# EAGLE design floppyswitch_4layer_smd (EAGLE 7.7.0)
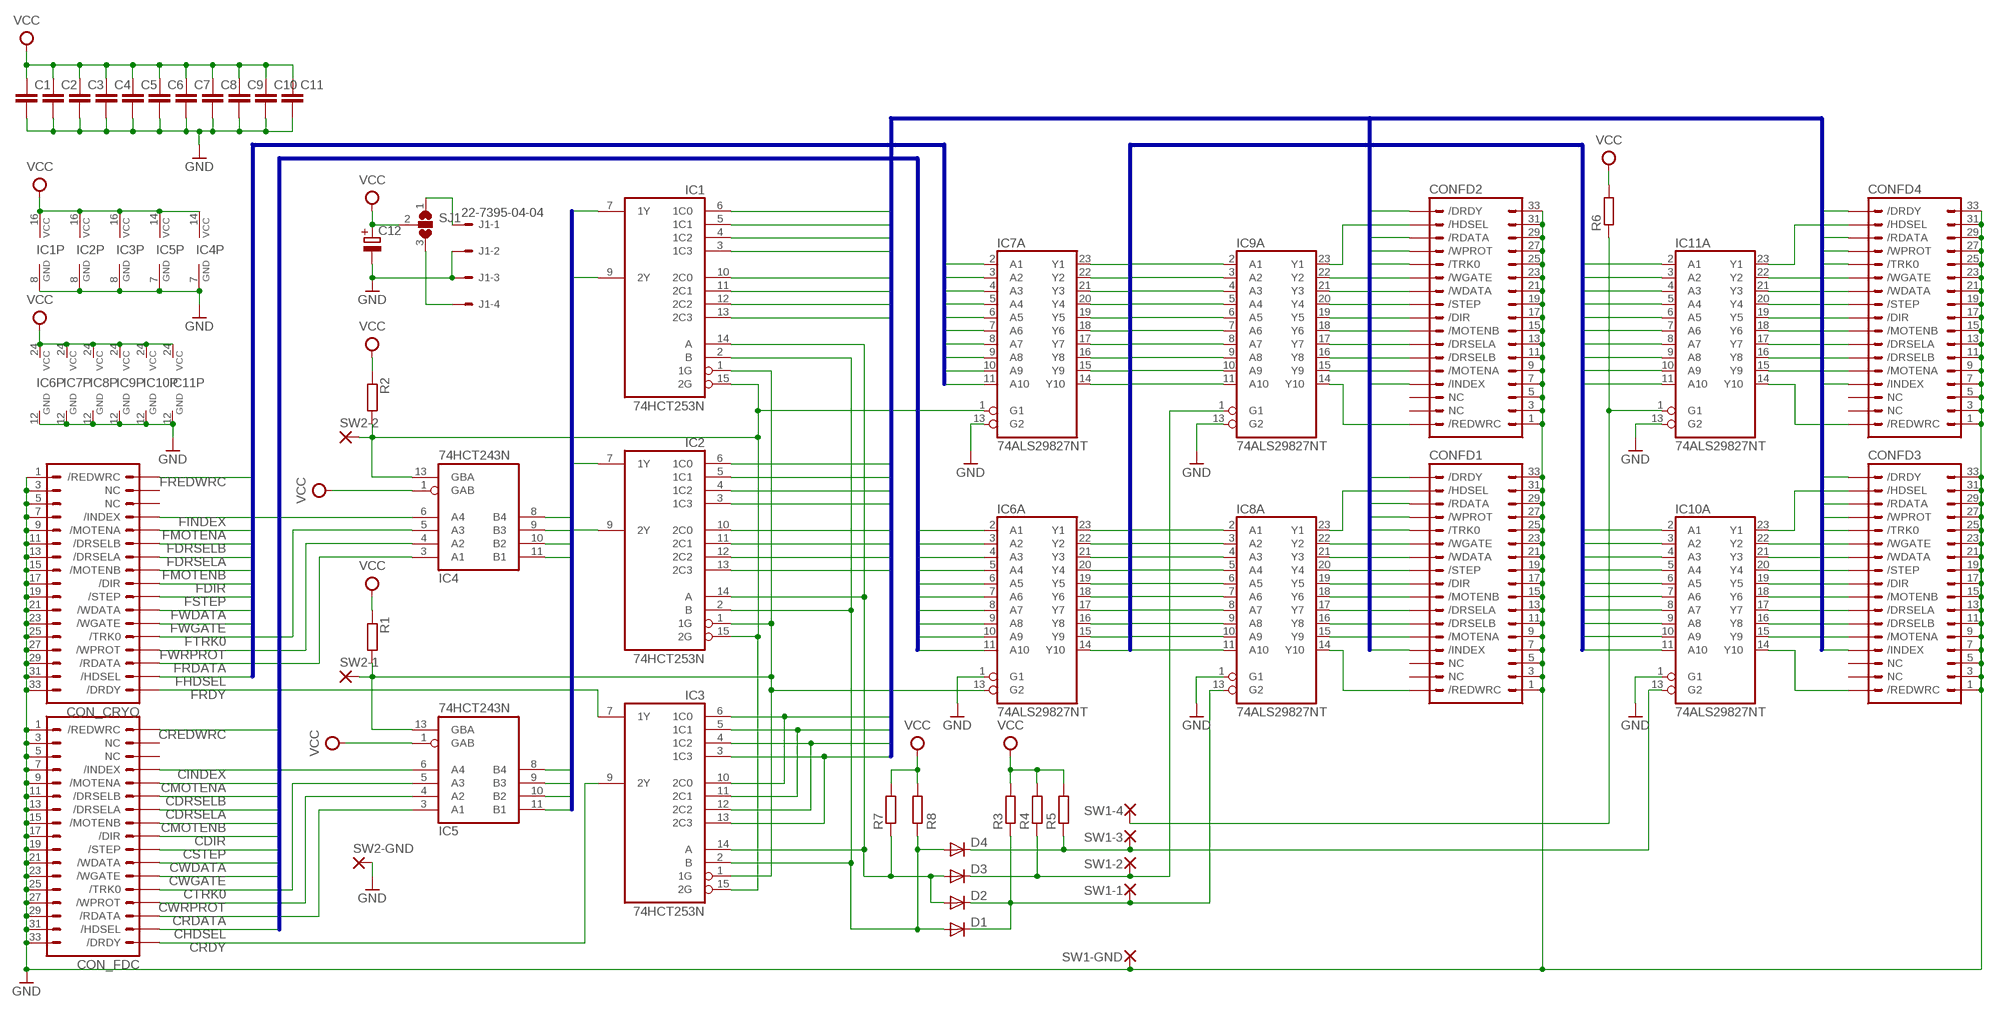
[diagram p0: schematic, sheet 1]

## Parts
C1  C-EU075-032X103  [C075-032X103]
C2  C-EU025-025X050  [C025-025X050]
C3  C-EU050-025X075  [C050-025X075]
C4  C-EU050-025X075  [C050-025X075]
C5  C-EU075-032X103  [C075-032X103]
C6  C-EU075-032X103  [C075-032X103]
C7  C-EU075-032X103  [C075-032X103]
C8  C-EU075-032X103  [C075-032X103]
C9  C-EU075-032X103  [C075-032X103]
C10  C-EU075-032X103  [C075-032X103]
C11  C-EU050-025X075  [C050-025X075]
C12  CPOL-EUE2.5-6  [E2,5-6]
CON_CRYO  FDC342X17  [2X17]
CON_FDC  FDC342X17  [2X17]
CONFD1  FDC342X17  [2X17]
CONFD2  FDC342X17  [2X17]
CONFD3  FDC342X17  [2X17]
CONFD4  FDC342X17  [2X17]
D1  1N4148-7  [DO35-7]
D2  1N4148-7  [DO35-7]
D3  1N4148-7  [DO35-7]
D4  1N4148-7  [DO35-7]
IC1  74HCT253N  [DIL16]
IC2  74HCT253N  [DIL16]
IC3  74HCT253N  [DIL16]
IC4  74HCT243N  [DIL14]
IC5  74HCT243N  [DIL14]
IC6  74ALS29827NT  [SO24W]
IC7  74ALS29827NT  [SO24W]
IC8  74ALS29827NT  [SO24W]
IC9  74ALS29827NT  [SO24W]
IC10  74ALS29827NT  [SO24W]
IC11  74ALS29827NT  [SO24W]
J1  22-7395-04-04  [7395-04]
R1  R-EU0207/10  [0207/10]
R2  R-EU0207/10  [0207/10]
R3  R-EU0207/10  [0207/10]
R4  R-EU0207/10  [0207/10]
R5  R-EU0207/10  [0207/10]
R6  R-EU0207/10  [0207/10]
R7  R-EU0207/10  [0207/10]
R8  R-EU0207/10  [0207/10]
SJ1  SJ2W  [SJ_2]
SW1-1  WIREPAD1,6/0,8  [1,6/0,8]
SW1-2  WIREPAD1,6/0,8  [1,6/0,8]
SW1-3  WIREPAD1,6/0,8  [1,6/0,8]
SW1-4  WIREPAD1,6/0,8  [1,6/0,8]
SW1-GND  WIREPAD1,6/0,8  [1,6/0,8]
SW2-1  WIREPAD1,6/0,8  [1,6/0,8]
SW2-2  WIREPAD1,6/0,8  [1,6/0,8]
SW2-GND  WIREPAD1,6/0,8  [1,6/0,8]

## Nets
BUS1: IC6.14(A:Y10) IC7.14(A:Y10) IC8.11(A:A10) IC9.11(A:A10) IC10.11(A:A10) IC11.11(A:A10)
BUS2: IC6.15(A:Y9) IC7.15(A:Y9) IC8.10(A:A9) IC9.10(A:A9) IC10.10(A:A9) IC11.10(A:A9)
BUS3: IC6.16(A:Y8) IC7.16(A:Y8) IC8.9(A:A8) IC9.9(A:A8) IC10.9(A:A8) IC11.9(A:A8)
BUS4: IC6.17(A:Y7) IC7.17(A:Y7) IC8.8(A:A7) IC9.8(A:A7) IC10.8(A:A7) IC11.8(A:A7)
BUS5: IC6.18(A:Y6) IC7.18(A:Y6) IC8.7(A:A6) IC9.7(A:A6) IC10.7(A:A6) IC11.7(A:A6)
BUS6: IC6.19(A:Y5) IC7.19(A:Y5) IC8.6(A:A5) IC9.6(A:A5) IC10.6(A:A5) IC11.6(A:A5)
BUS7: IC6.20(A:Y4) IC7.20(A:Y4) IC8.5(A:A4) IC9.5(A:A4) IC10.5(A:A4) IC11.5(A:A4)
BUS8: IC6.21(A:Y3) IC7.21(A:Y3) IC8.4(A:A3) IC9.4(A:A3) IC10.4(A:A3) IC11.4(A:A3)
BUS9: IC6.22(A:Y2) IC7.22(A:Y2) IC8.3(A:A2) IC9.3(A:A2) IC10.3(A:A2) IC11.3(A:A2)
BUS10: IC6.23(A:Y1) IC7.23(A:Y1) IC8.2(A:A1) IC9.2(A:A1) IC10.2(A:A1) IC11.2(A:A1)
CDIR: CON_FDC.18(/DIR) IC6.6(A:A5)
CDRSELA: CON_FDC.14(/DRSELA) IC6.8(A:A7)
CDRSELB: CON_FDC.12(/DRSELB) IC6.9(A:A8)
CHDSEL: CON_FDC.32(/HDSEL) IC6.2(A:A1)
CINDEX: CON_FDC.8(/INDEX) IC5.6(A4)
CMOTENA: CON_FDC.10(/MOTENA) IC6.10(A:A9)
CMOTENB: CON_FDC.16(/MOTENB) IC6.7(A:A6)
CRDATA: CON_FDC.30(/RDATA) IC5.3(A1)
CRDY: CON_FDC.34(/DRDY) IC3.9(2Y)
CREDWRC: CON_FDC.2(/REDWRC) IC6.11(A:A10)
CSTEP: CON_FDC.20(/STEP) IC6.5(A:A4)
CTRK0: CON_FDC.26(/TRK0) IC5.5(A3)
CWDATA: CON_FDC.22(/WDATA) IC6.4(A:A3)
CWGATE: CON_FDC.24(/WGATE) IC6.3(A:A2)
CWRPROT: CON_FDC.28(/WPROT) IC5.4(A2)
FDIR: CON_CRYO.18(/DIR) IC7.6(A:A5)
FDRSELA: CON_CRYO.14(/DRSELA) IC7.8(A:A7)
FDRSELB: CON_CRYO.12(/DRSELB) IC7.9(A:A8)
FHDSEL: CON_CRYO.32(/HDSEL) IC7.2(A:A1)
FINDEX: CON_CRYO.8(/INDEX) IC4.6(A4)
FMOTENA: CON_CRYO.10(/MOTENA) IC7.10(A:A9)
FMOTENB: CON_CRYO.16(/MOTENB) IC7.7(A:A6)
FRDATA: CON_CRYO.30(/RDATA) IC4.3(A1)
FRDY: CON_CRYO.34(/DRDY) IC3.7(1Y)
FREDWRC: CON_CRYO.2(/REDWRC) IC7.11(A:A10)
FSTEP: CON_CRYO.20(/STEP) IC7.5(A:A4)
FTRK0: CON_CRYO.26(/TRK0) IC4.5(A3)
FWDATA: CON_CRYO.22(/WDATA) IC7.4(A:A3)
FWGATE: CON_CRYO.24(/WGATE) IC7.3(A:A2)
FWRPROT: CON_CRYO.28(/WPROT) IC4.4(A2)
GND: C1.2 C2.2 C3.2 C4.2 C5.2 C6.2 C7.2 C8.2 C9.2 C10.2 C11.2 C12.- CON_CRYO.1 CON_CRYO.3 CON_CRYO.5 CON_CRYO.7 CON_CRYO.9 CON_CRYO.11 CON_CRYO.13 CON_CRYO.15 CON_CRYO.17 CON_CRYO.19 CON_CRYO.21 CON_CRYO.23 CON_CRYO.25 CON_CRYO.27 CON_CRYO.29 CON_CRYO.31 CON_CRYO.33 CON_FDC.1 CON_FDC.3 CON_FDC.5 CON_FDC.7 CON_FDC.9 CON_FDC.11 CON_FDC.13 CON_FDC.15 CON_FDC.17 CON_FDC.19 CON_FDC.21 CON_FDC.23 CON_FDC.25 CON_FDC.27 CON_FDC.29 CON_FDC.31 CON_FDC.33 CONFD1.1 CONFD1.3 CONFD1.5 CONFD1.7 CONFD1.9 CONFD1.11 CONFD1.13 CONFD1.15 CONFD1.17 CONFD1.19 CONFD1.21 CONFD1.23 CONFD1.25 CONFD1.27 CONFD1.29 CONFD1.31 CONFD1.33 CONFD2.1 CONFD2.3 CONFD2.5 CONFD2.7 CONFD2.9 CONFD2.11 CONFD2.13 CONFD2.15 CONFD2.17 CONFD2.19 CONFD2.21 CONFD2.23 CONFD2.25 CONFD2.27 CONFD2.29 CONFD2.31 CONFD2.33 CONFD3.1 CONFD3.3 CONFD3.5 CONFD3.7 CONFD3.9 CONFD3.11 CONFD3.13 CONFD3.15 CONFD3.17 CONFD3.19 CONFD3.21 CONFD3.23 CONFD3.25 CONFD3.27 CONFD3.29 CONFD3.31 CONFD3.33 CONFD4.1 CONFD4.3 CONFD4.5 CONFD4.7 CONFD4.9 CONFD4.11 CONFD4.13 CONFD4.15 CONFD4.17 CONFD4.19 CONFD4.21 CONFD4.23 CONFD4.25 CONFD4.27 CONFD4.29 CONFD4.31 CONFD4.33 IC1.8(GND) IC2.8(GND) IC3.8(GND) IC4.7(GND) IC5.7(GND) IC6.1(A:G1) IC6.12(P:GND) IC7.12(P:GND) IC7.13(A:G2) IC8.1(A:G1) IC8.12(P:GND) IC9.12(P:GND) IC9.13(A:G2) IC10.1(A:G1) IC10.12(P:GND) IC11.12(P:GND) IC11.13(A:G2) J1.2 J1.3 SW1-GND.1(P) SW2-GND.1(P)
INDEX: IC1.7(1Y) IC4.8(B4) IC5.8(B4)
INDEX1: CONFD1.8(/INDEX) IC1.6(1C0)
INDEX2: CONFD2.8(/INDEX) IC1.5(1C1)
INDEX3: CONFD3.8(/INDEX) IC1.4(1C2)
INDEX4: CONFD4.8(/INDEX) IC1.3(1C3)
N$1: CONFD2.10(/MOTENA) IC9.15(A:Y9)
N$2: CONFD2.12(/DRSELB) IC9.16(A:Y8)
N$3: CONFD2.14(/DRSELA) IC9.17(A:Y7)
N$4: CONFD2.16(/MOTENB) IC9.18(A:Y6)
N$5: CONFD2.18(/DIR) IC9.19(A:Y5)
N$6: CONFD2.20(/STEP) IC9.20(A:Y4)
N$7: CONFD2.22(/WDATA) IC9.21(A:Y3)
N$8: CONFD2.24(/WGATE) IC9.22(A:Y2)
N$9: CONFD2.32(/HDSEL) IC9.23(A:Y1)
N$10: CONFD2.2(/REDWRC) IC9.14(A:Y10)
N$11: CONFD1.24(/WGATE) IC8.22(A:Y2)
N$12: CONFD1.22(/WDATA) IC8.21(A:Y3)
N$13: CONFD1.20(/STEP) IC8.20(A:Y4)
N$14: CONFD1.18(/DIR) IC8.19(A:Y5)
N$15: CONFD1.16(/MOTENB) IC8.18(A:Y6)
N$16: CONFD1.14(/DRSELA) IC8.17(A:Y7)
N$17: CONFD1.12(/DRSELB) IC8.16(A:Y8)
N$18: IC1.1(1G) IC2.1(1G) IC3.1(1G) IC5.13(GBA) IC6.13(A:G2) R1.2 SW2-1.1(P)
N$19: CONFD1.10(/MOTENA) IC8.15(A:Y9)
N$20: CONFD1.2(/REDWRC) IC8.14(A:Y10)
N$21: CONFD1.32(/HDSEL) IC8.23(A:Y1)
N$22: CONFD3.32(/HDSEL) IC10.23(A:Y1)
N$23: CONFD3.24(/WGATE) IC10.22(A:Y2)
N$24: CONFD3.22(/WDATA) IC10.21(A:Y3)
N$25: CONFD3.20(/STEP) IC10.20(A:Y4)
N$26: CONFD3.18(/DIR) IC10.19(A:Y5)
N$27: CONFD3.16(/MOTENB) IC10.18(A:Y6)
N$28: CONFD3.14(/DRSELA) IC10.17(A:Y7)
N$29: CONFD3.12(/DRSELB) IC10.16(A:Y8)
N$30: CONFD3.10(/MOTENA) IC10.15(A:Y9)
N$31: CONFD3.2(/REDWRC) IC10.14(A:Y10)
N$32: CONFD4.24(/WGATE) IC11.22(A:Y2)
N$33: CONFD4.22(/WDATA) IC11.21(A:Y3)
N$34: CONFD4.20(/STEP) IC11.20(A:Y4)
N$35: CONFD4.18(/DIR) IC11.19(A:Y5)
N$36: CONFD4.16(/MOTENB) IC11.18(A:Y6)
N$37: CONFD4.14(/DRSELA) IC11.17(A:Y7)
N$38: CONFD4.12(/DRSELB) IC11.16(A:Y8)
N$39: CONFD4.10(/MOTENA) IC11.15(A:Y9)
N$40: CONFD4.2(/REDWRC) IC11.14(A:Y10)
N$41: CONFD4.32(/HDSEL) IC11.23(A:Y1)
N$42: IC1.15(2G) IC2.15(2G) IC3.15(2G) IC4.13(GBA) IC7.1(A:G1) R2.2 SW2-2.1(P)
N$43: D3.C IC9.1(A:G1) R4.1 SW1-2.1(P)
N$44: J1.4 SJ1.3
N$45: IC11.1(A:G1) R6.1 SW1-4.1(P)
N$46: D4.C IC10.13(A:G2) R5.1 SW1-3.1(P)
N$47: D2.A D3.A IC1.14(A) IC2.14(A) IC3.14(A) R7.1
N$48: D1.A D4.A IC1.2(B) IC2.2(B) IC3.2(B) R8.1
N$49: J1.1 SJ1.1
N$51: D1.C D2.C IC8.13(A:G2) R3.1 SW1-1.1(P)
RDATA: IC2.9(2Y) IC4.11(B1) IC5.11(B1)
RDATA1: CONFD1.30(/RDATA) IC2.10(2C0)
RDATA2: CONFD2.30(/RDATA) IC2.11(2C1)
RDATA3: CONFD3.30(/RDATA) IC2.12(2C2)
RDATA4: CONFD4.30(/RDATA) IC2.13(2C3)
RDY1: CONFD1.34(/DRDY) IC3.6(1C0) IC3.10(2C0)
RDY2: CONFD2.34(/DRDY) IC3.5(1C1) IC3.11(2C1)
RDY3: CONFD3.34(/DRDY) IC3.4(1C2) IC3.12(2C2)
RDY4: CONFD4.34(/DRDY) IC3.3(1C3) IC3.13(2C3)
TRK0: IC1.9(2Y) IC4.9(B3) IC5.9(B3)
TRKZ1: CONFD1.26(/TRK0) IC1.10(2C0)
TRKZ2: CONFD2.26(/TRK0) IC1.11(2C1)
TRKZ3: CONFD3.26(/TRK0) IC1.12(2C2)
TRKZ4: CONFD4.26(/TRK0) IC1.13(2C3)
VCC: C1.1 C2.1 C3.1 C4.1 C5.1 C6.1 C7.1 C8.1 C9.1 C10.1 C11.1 C12.+ IC1.16(VCC) IC2.16(VCC) IC3.16(VCC) IC4.1(GAB) IC4.14(VCC) IC5.1(GAB) IC5.14(VCC) IC6.24(P:VCC) IC7.24(P:VCC) IC8.24(P:VCC) IC9.24(P:VCC) IC10.24(P:VCC) IC11.24(P:VCC) R1.1 R2.1 R3.2 R4.2 R5.2 R6.2 R7.2 R8.2 SJ1.2
WRPROT: IC2.7(1Y) IC4.10(B2) IC5.10(B2)
WRPROT1: CONFD1.28(/WPROT) IC2.6(1C0)
WRPROT2: CONFD2.28(/WPROT) IC2.5(1C1)
WRPROT3: CONFD3.28(/WPROT) IC2.4(1C2)
WRPROT4: CONFD4.28(/WPROT) IC2.3(1C3)
Unconnected: CON_CRYO.4(NC) CON_CRYO.6(NC) CON_FDC.4(NC) CON_FDC.6(NC) CONFD1.4(NC) CONFD1.6(NC) CONFD2.4(NC) CONFD2.6(NC) CONFD3.4(NC) CONFD3.6(NC) CONFD4.4(NC) CONFD4.6(NC)

## Buses
INDEX,TRK0,WRPROT,RDATA
INDEX[1..4],TRKZ[1..4],WRPROT[1..4],RDATA[1..4],RDY[1..4]
FREDWRC,FMOTENA,FDRSELA,FDRSELB,FMOTENB,FDIR,FSTEP,FWDATA,FWGATE,FHDSEL
CREDWRC,CMOTENA,CDRSELA,CDRSELB,CMOTENB,CDIR,CSTEP,CWDATA,CWGATE,CHDSEL
BUS[1..10]

## Library data of the parts
C1-C11 = rcl-rs:C-EU: CAPACITOR, European symbol
C12 = rcl-rs:CPOL-EU: POLARIZED CAPACITOR, European symbol
CON_CRYO CON_FDC CONFD1-CONFD4 = con-pc:FDC34: PIN HEADER
D1-D4 = diode-rs:1N4148: DIODE high speed (Philips)
IC1-IC3 = 74xx-eu:74*253: Dual 4-to 1 line data SELECTOR/MULTIPLEXER, 3-state
IC4 IC5 = 74xx-eu:74*243: Quadruple BUS TRANSCEIVER
IC6-IC11 = 74xx-eu:74*29827: 10-bit Bus Buffer
J1 = con-molex:22-?-04: CONNECTOR wire to board 2.54 mm (.1 inch) pitch header Used for 3.5" floppy drive power connector 1 - +5V 1 - GND 1 - GND 4 - +12V
R1-R8 = rcl-rs:R-EU: RESISTOR, European symbol
SJ1 = jumper-rs:SJ2W: SMD solder JUMPER
SW1-1-SW1-4 SW1-GND SW2-1 SW2-2 SW2-GND = con-solderpad:WIREPAD: Wire PAD connect wire on PCB

## Board
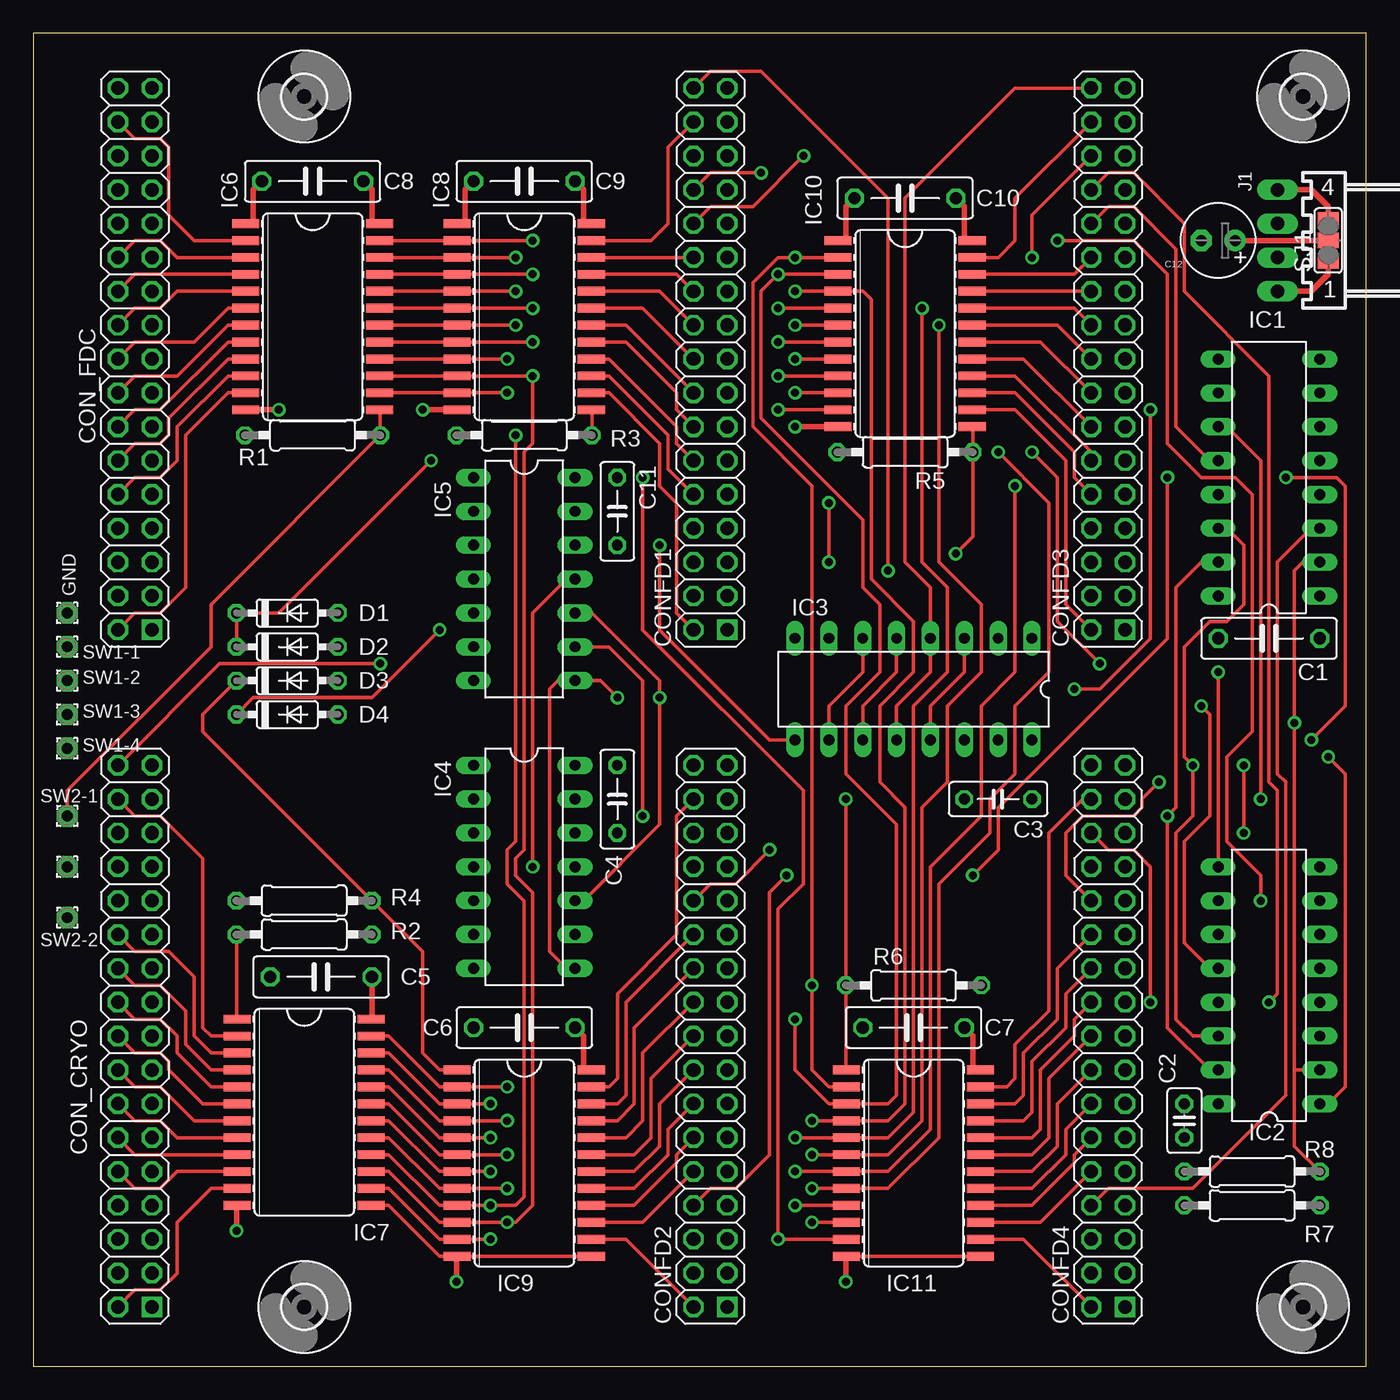
[diagram p1: board, top side]
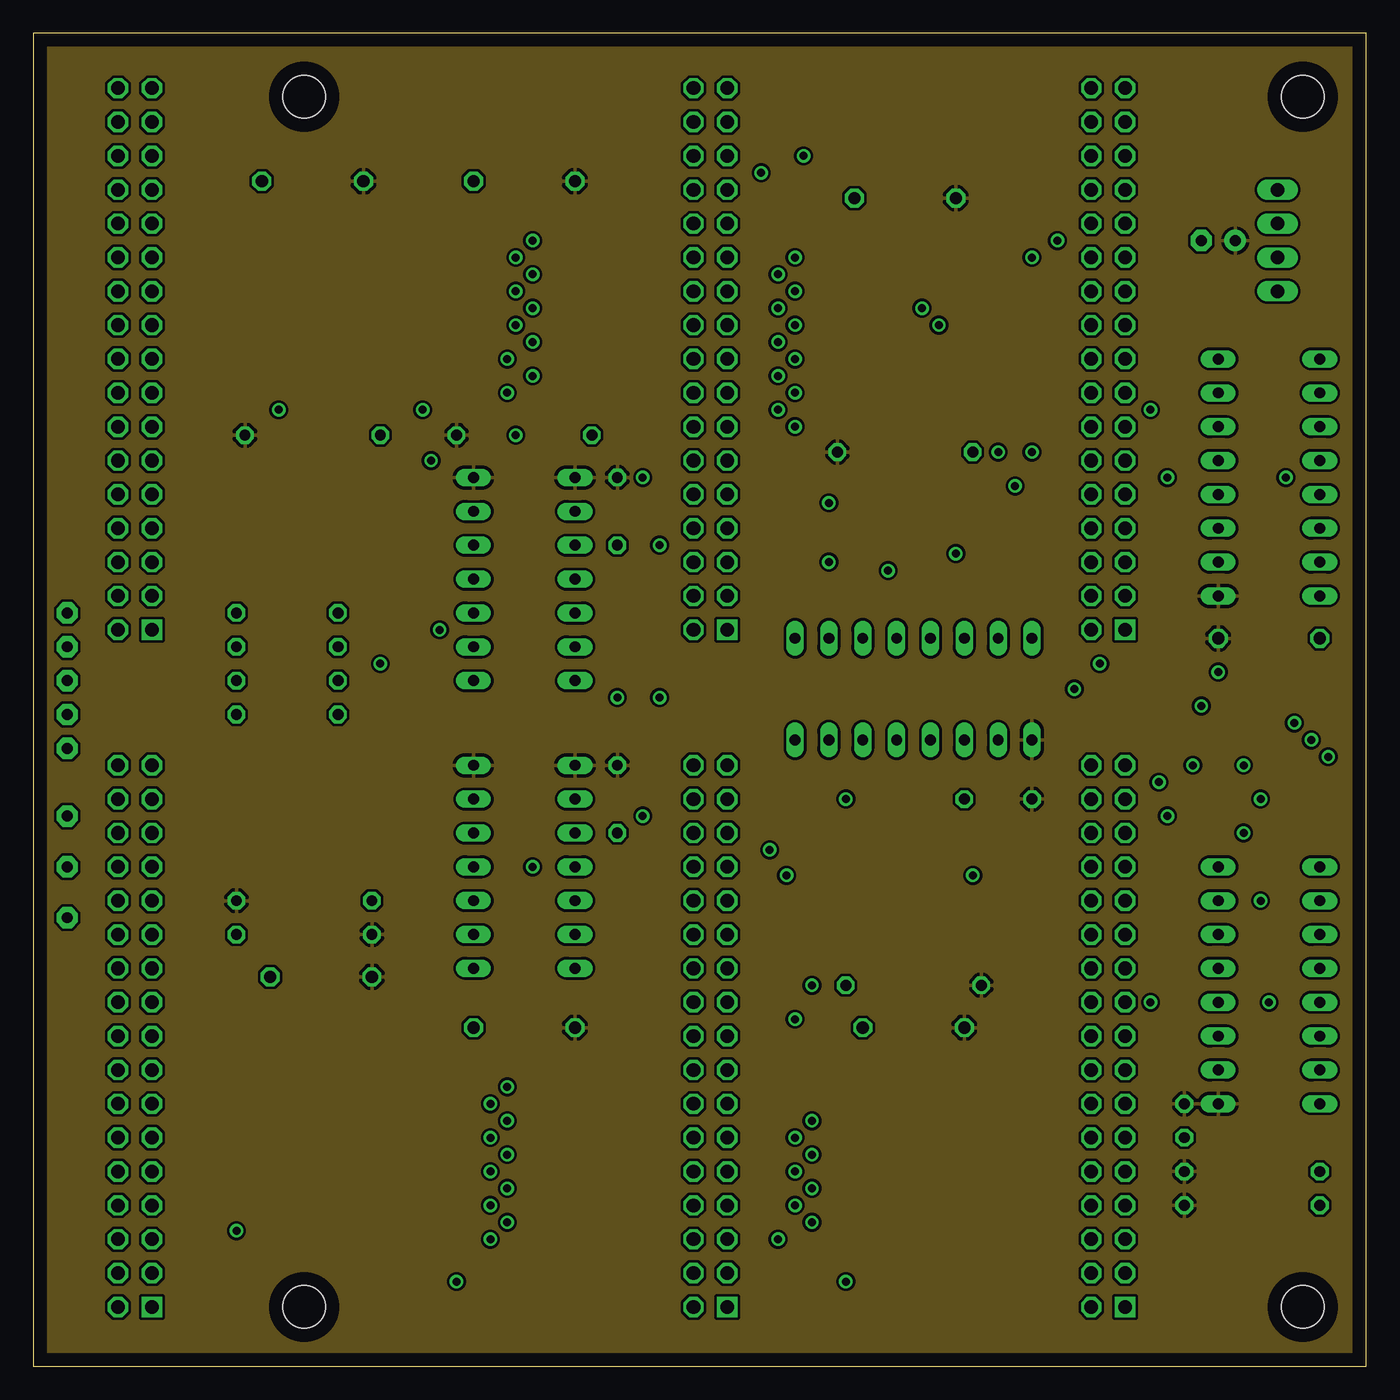
[diagram p2: board, inner layer Route2]
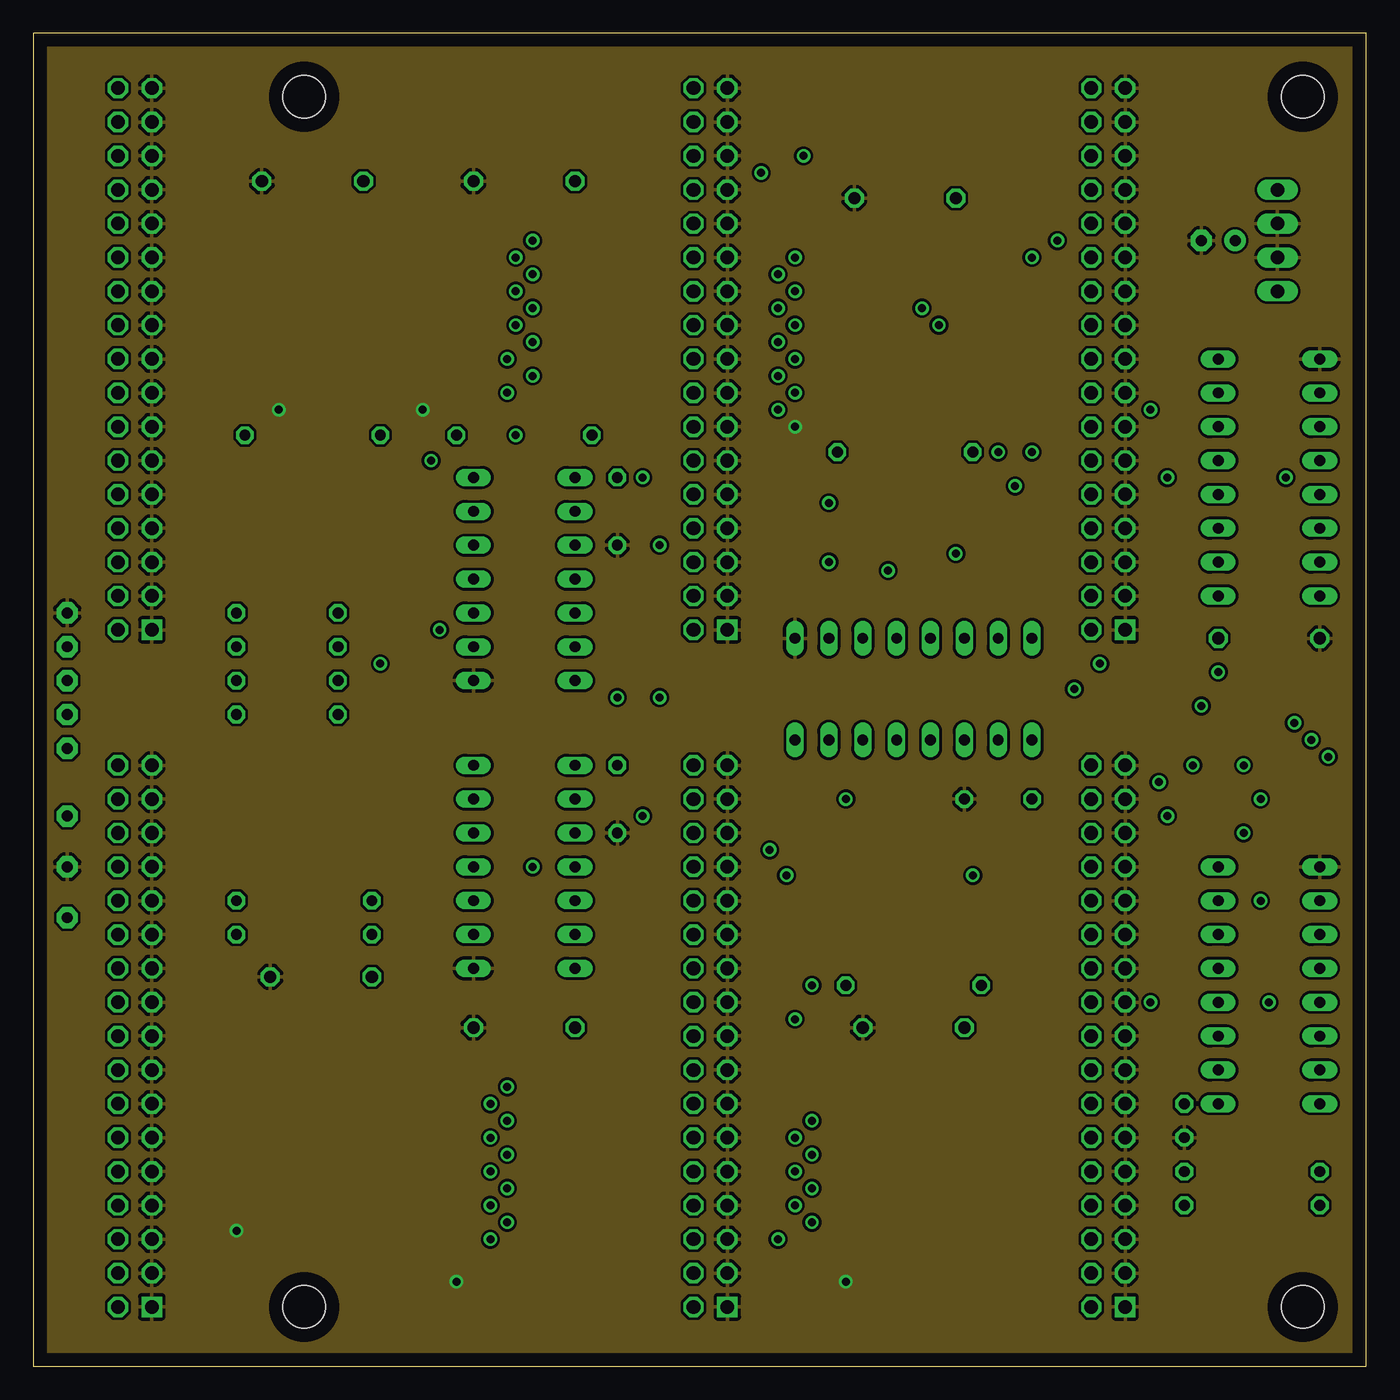
[diagram p3: board, inner layer Route15]
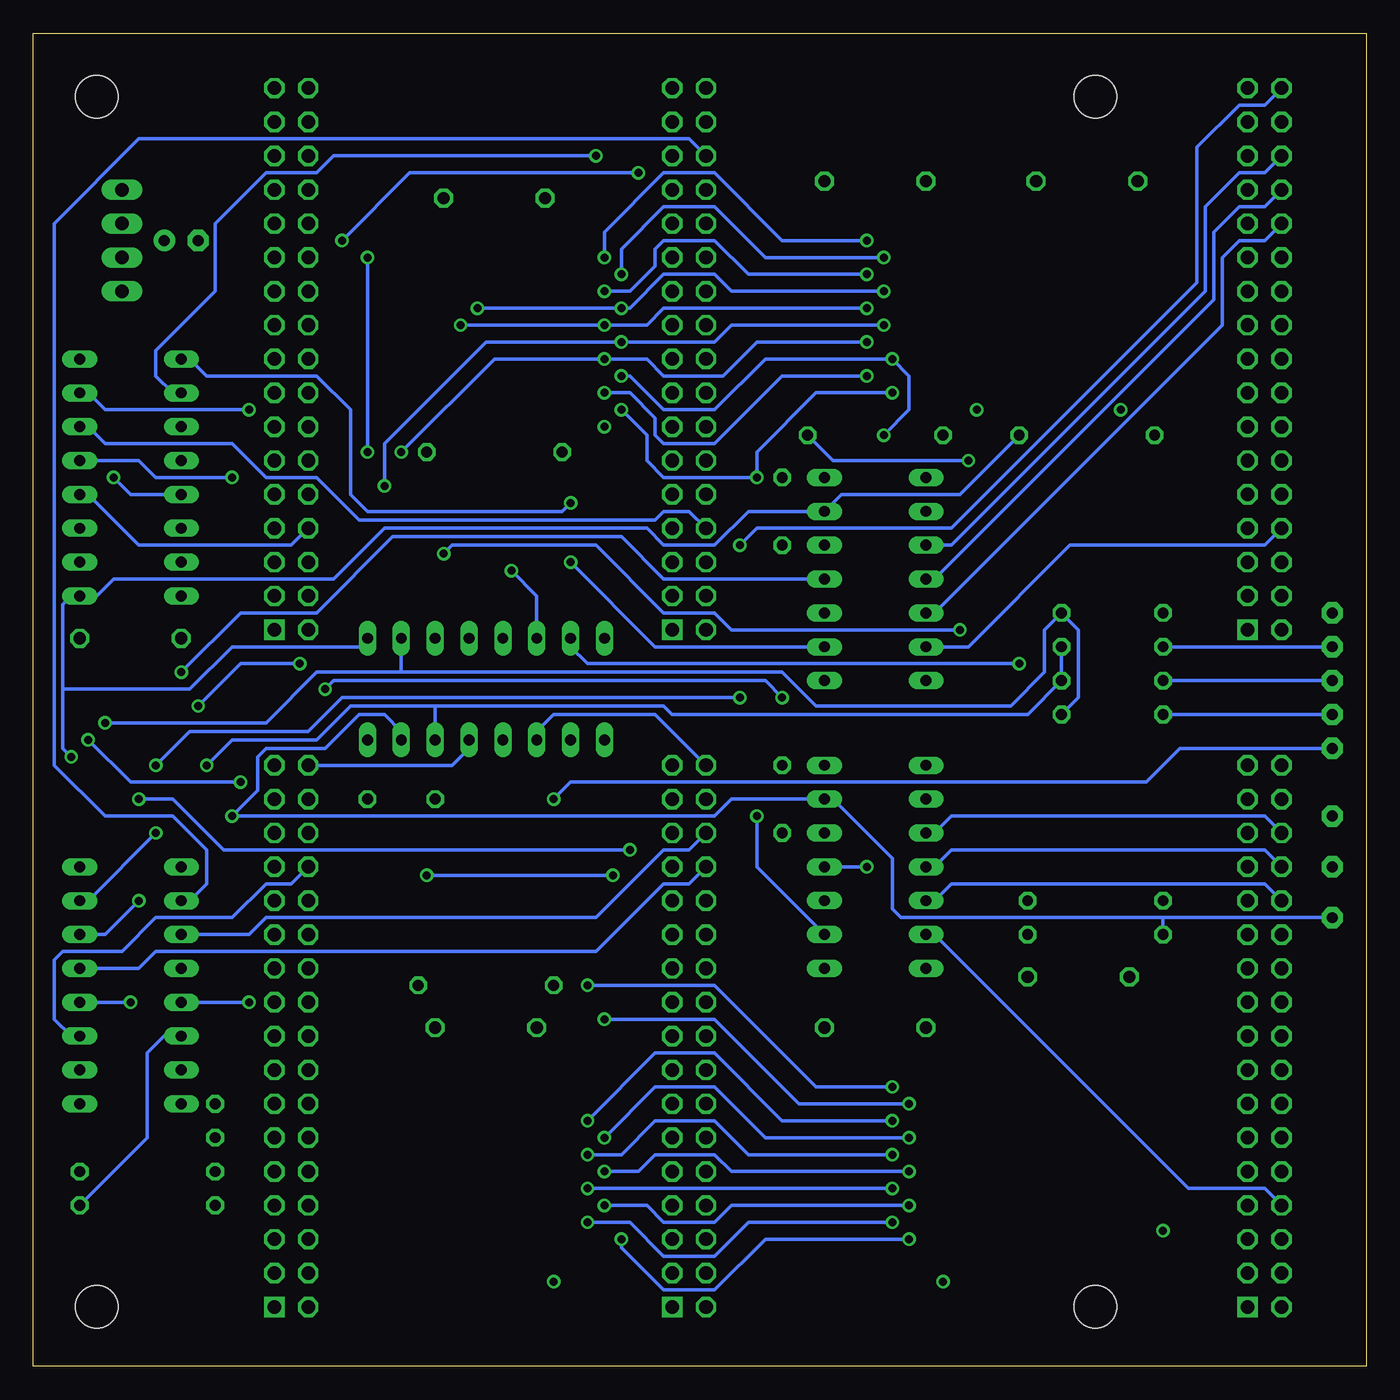
[diagram p4: board, bottom side, seen from below]

Size 100 x 100 mm. Coordinates in mm from the lower left corner, seen from the top.
Outline: 0,0 100,0 100,100 0,100 0,0
Copper layers (1*2+15*16): Top 0.035mm / dielectric 0.2mm / Route2 0.035mm / dielectric 1.2mm / Route15 0.035mm / dielectric 0.2mm / Bottom 0.035mm
Design rules "default *": minimum track width 10mil, minimum drill 0.6mm, track to track 8mil, track to pad 8mil, pad to pad 8mil, via to via 8mil, smd to smd 8mil, copper to edge 40mil, drill to drill 8mil, minimum pad ring 10mil, minimum via ring 8mil, stop-mask expansion 4mil, vias tented up to drill 0mil, thermal gap 10mil

### Footprints (pad centres in the part's own frame; a part is rotated, then mirrored left to right if it is on the bottom)
C075-032X103 = drill 0.914 octagon: 1 -3.81,0; 2 3.81,0
C025-025X050 = drill 0.813 octagon: 1 -1.27,0; 2 1.27,0
C050-025X075 = drill 0.813 octagon: 1 -2.54,0; 2 2.54,0
E2,5-6 = drill 0.813 pad 1.6: + -1.27,0 | drill 0.813 pad 1.6 octagon: - 1.27,0
2X17 = drill 1.016 square: 1 -20.32,-1.27 | drill 1.016 octagon: 2 -20.32,1.27; 3 -17.78,-1.27; 4 -17.78,1.27; 5 -15.24,-1.27; 6 -15.24,1.27; 7 -12.7,-1.27; 8 -12.7,1.27; 9 -10.16,-1.27; 10 -10.16,1.27; 11 -7.62,-1.27; 12 -7.62,1.27; 13 -5.08,-1.27; 14 -5.08,1.27; 15 -2.54,-1.27; 16 -2.54,1.27; 17 0,-1.27; 18 0,1.27; 19 2.54,-1.27; 20 2.54,1.27; 21 5.08,-1.27; 22 5.08,1.27; 23 7.62,-1.27; 24 7.62,1.27; 25 10.16,-1.27; 26 10.16,1.27; 27 12.7,-1.27; 28 12.7,1.27; 29 15.24,-1.27; 30 15.24,1.27; 31 17.78,-1.27; 32 17.78,1.27; 33 20.32,-1.27; 34 20.32,1.27
DO35-7 = drill 0.813 octagon: A 3.81,0; C -3.81,0
DIL16 = drill 0.813 long: 1 -8.89,-3.81; 2 -6.35,-3.81; 3 -3.81,-3.81; 4 -1.27,-3.81; 5 1.27,-3.81; 6 3.81,-3.81; 7 6.35,-3.81; 8 8.89,-3.81; 9 8.89,3.81; 10 6.35,3.81; 11 3.81,3.81; 12 1.27,3.81; 13 -1.27,3.81; 14 -3.81,3.81; 15 -6.35,3.81; 16 -8.89,3.81
DIL14 = drill 0.813 long: 1 -7.62,-3.81; 2 -5.08,-3.81; 3 -2.54,-3.81; 4 0,-3.81; 5 2.54,-3.81; 6 5.08,-3.81; 7 7.62,-3.81; 8 7.62,3.81; 9 5.08,3.81; 10 2.54,3.81; 11 0,3.81; 12 -2.54,3.81; 13 -5.08,3.81; 14 -7.62,3.81
SO24W = smd 0.66 x 2.032: 1 -6.985,-5.029; 2 -5.715,-5.029; 3 -4.445,-5.029; 4 -3.175,-5.029; 5 -1.905,-5.029; 6 -0.635,-5.029; 7 0.635,-5.029; 8 1.905,-5.029; 9 3.175,-5.029; 10 4.445,-5.029; 11 5.715,-5.029; 12 6.985,-5.029; 13 6.985,5.029; 14 5.715,5.029; 15 4.445,5.029; 16 3.175,5.029; 17 1.905,5.029; 18 0.635,5.029; 19 -0.635,5.029; 20 -1.905,5.029; 21 -3.175,5.029; 22 -4.445,5.029; 23 -5.715,5.029; 24 -6.985,5.029
7395-04 = drill 1.016 long: 1 -3.81,0; 2 -1.27,0; 3 1.27,0; 4 3.81,0
0207/10 = drill 0.813 octagon: 1 -5.08,0; 2 5.08,0
SJ_2 = smd 1.168 x 1.6: 1 -1.524,0; 2 0,0; 3 1.524,0
1,6/0,8 = drill 0.813 pad 1.6 octagon: 1 0,0
3,2 = hole 3.2: 0,0

### Placement (x,y rotation side)
C1  92.71,54.61 0 top
C2  86.36,18.41 270 top
C3  72.39,42.55 180 top
C4  43.81,42.55 270 top
C5  21.59,29.21 180 top
C6  36.83,25.4 180 top
C7  66.04,25.4 180 top
C8  20.95,88.9 180 top
C9  36.83,88.9 180 top
C10  65.41,87.63 180 top
C11  43.81,64.14 270 top
C12  88.9,84.45 180 top
CON_CRYO  7.62,24.77 90 top
CON_FDC  7.62,75.56 90 top
CONFD1  50.8,75.56 90 top
CONFD2  50.8,24.77 90 top
CONFD3  80.64,75.56 90 top
CONFD4  80.64,24.77 90 top
D1  19.05,56.52 0 top
D2  19.05,53.98 0 top
D3  19.05,51.44 0 top
D4  19.05,48.9 0 top
IC1  92.71,66.67 90 top
IC2  92.71,28.57 90 top
IC3  66.04,50.8 180 top
IC4  36.83,37.47 270 top
IC5  36.83,59.05 270 top
IC6  20.95,78.74 270 top
IC7  20.32,19.05 270 top
IC8  36.83,78.74 270 top
IC9  36.83,15.24 270 top
IC10  65.41,77.47 270 top
IC11  66.04,15.24 270 top
J1  93.34,84.45 90 top
R1  20.95,69.85 0 top
R2  20.32,32.38 180 top
R3  36.83,69.85 180 top
R4  20.32,34.92 180 top
R5  65.41,68.58 180 top
R6  66.04,28.57 0 top
R7  91.44,12.06 180 top
R8  91.44,14.61 180 top
SJ1  97.16,84.45 90 top
SW1-1  2.54,53.98 270 top
SW1-2  2.54,51.44 0 top
SW1-3  2.54,48.9 0 top
SW1-4  2.54,46.35 0 top
SW1-GND  2.54,56.52 0 top
SW2-1  2.54,41.27 0 top
SW2-2  2.54,33.66 0 top
SW2-GND  2.54,37.47 0 top
U$1  [3,2]  20.32,4.45 0 top
U$2  [3,2]  20.32,95.25 0 top
U$3  [3,2]  95.25,4.45 0 top
U$4  [3,2]  95.25,95.25 0 top

### Tracks (layer width: path | path; a pad name or v marks a point on that pad's centre or on a via)
BUS1  (via drill 0.6)
  Top 0.254: IC6.14 IC8.11 v35.56,73.03 | IC10.11 v55.88,71.75 | v34.29,9.53 IC9.11 30.48,9.53 26.67,13.34 IC7.14 | IC11.11 v55.88,9.53 55.88,34.29 57.78,36.2 57.78,43.18 45.72,55.24 v45.72,66.67
  Bottom 0.254: v55.88,71.75 53.98,69.85 53.98,67.94 52.7,66.67 v45.72,66.67 45.72,68.58 41.27,73.03 v35.56,73.03 | v34.29,9.53 45.09,9.53 48.9,5.71 52.7,5.71 55.88,8.89 v55.88,9.53
BUS2  (via drill 0.6)
  Top 0.254: IC6.15 IC8.10 v37.47,74.3 37.47,69.22 36.83,68.58 36.83,38.73 36.2,38.1 36.2,36.83 37.47,35.56 37.47,12.06 36.2,10.79 v35.56,10.79 IC9.10 30.48,10.79 26.67,14.61 IC7.15 | IC10.10 v57.15,73.03 | IC11.10 v58.42,10.79
  Bottom 0.254: v37.47,74.3 43.81,74.3 48.9,69.22 52.7,69.22 53.34,69.85 53.34,71.12 55.24,73.03 v57.15,73.03 | v35.56,10.79 46.35,10.79 48.9,8.26 52.7,8.26 55.24,10.79 v58.42,10.79
BUS3  (via drill 0.6)
  Top 0.254: IC6.16 IC8.9 v35.56,75.56 | v55.88,74.3 IC10.9 | IC11.9 v57.15,12.06 | v36.2,69.85 36.2,39.37 35.56,38.73 35.56,36.2 36.83,34.92 36.83,12.7 36.2,12.06 v34.29,12.06 IC9.9 30.48,12.06 26.67,15.88 IC7.16
  Bottom 0.254: v55.88,74.3 55.24,74.3 52.7,71.75 48.9,71.75 45.09,75.56 v35.56,75.56 34.29,74.3 34.29,71.75 v36.2,69.85 | v34.29,12.06 47.62,12.06 48.9,10.79 52.7,10.79 53.98,12.06 v57.15,12.06
BUS4  (via drill 0.6)
  Top 0.254: IC6.17 IC8.8 v37.47,76.83 | v57.15,75.56 IC10.8 | v35.56,13.34 IC9.8 30.48,13.34 26.67,17.14 IC7.17 | v58.42,13.34 IC11.8 64.14,13.34 67.94,17.14 67.94,36.2 71.75,40.01 71.75,42.55 73.66,44.45 73.66,49.53 76.2,52.07 76.2,64.77 v72.39,68.58
  Bottom 0.254: v37.47,76.83 45.72,76.83 48.26,74.3 52.7,74.3 53.98,75.56 v57.15,75.56 65.41,75.56 v72.39,68.58 | v35.56,13.34 v58.42,13.34
BUS5  (via drill 0.6)
  Top 0.254: IC6.18 IC8.7 v36.2,78.11 | v55.88,76.83 IC10.7 | v57.15,14.61 IC11.7 64.14,14.61 67.31,17.78 67.31,37.47 71.12,41.27 71.12,49.53 73.66,52.07 v73.66,66.04 | v34.29,14.61 IC9.7 30.48,14.61 26.67,18.41 IC7.18
  Bottom 0.254: v36.2,78.11 47.62,78.11 48.9,76.83 v55.88,76.83 66.04,76.83 73.66,69.22 v73.66,66.04 | v34.29,14.61 47.62,14.61 48.9,15.88 53.34,15.88 54.61,14.61 v57.15,14.61
BUS6  (via drill 0.6)
  Top 0.254: IC6.19 IC8.6 v37.47,79.38 | IC10.6 v57.15,78.11 | v58.42,15.88 IC11.6 64.14,15.88 66.67,18.41 66.67,41.91 68.58,43.81 68.58,49.53 71.12,52.07 71.12,57.15 67.94,60.33 v67.94,78.11 | v35.56,15.88 IC9.6 30.48,15.88 26.67,19.68 IC7.19
  Bottom 0.254: v37.47,79.38 52.7,79.38 53.98,78.11 v57.15,78.11 v67.94,78.11 | v35.56,15.88 46.35,15.88 48.9,18.41 53.34,18.41 55.88,15.88 v58.42,15.88
BUS7  (via drill 0.6)
  Top 0.254: IC6.20 IC8.5 v36.2,80.64 | IC10.5 v55.88,79.38 | v57.15,17.14 IC11.5 64.14,17.14 66.04,19.05 66.04,49.53 68.58,52.07 68.58,58.42 66.67,60.33 v66.67,79.38 | v34.29,17.14 IC9.5 30.48,17.14 26.67,20.95 IC7.20
  Bottom 0.254: v36.2,80.64 47.62,80.64 48.9,81.92 52.7,81.92 55.24,79.38 v55.88,79.38 v66.67,79.38 | v34.29,17.14 45.09,17.14 48.9,20.95 53.34,20.95 v57.15,17.14
BUS8  (via drill 0.6)
  Top 0.254: IC6.21 IC8.4 v37.47,81.92 | v57.15,80.64 IC10.4 62.23,80.64 62.87,80.01 62.87,59.05 66.04,55.88 66.04,52.07 63.5,49.53 63.5,43.81 65.41,41.91 65.41,19.68 64.14,18.41 IC11.4 v58.42,18.41 | v35.56,18.41 IC9.4 30.48,18.41 26.67,22.23 IC7.21
  Bottom 0.254: v37.47,81.92 46.35,81.92 48.9,84.45 52.7,84.45 53.34,83.82 53.34,82.55 55.24,80.64 v57.15,80.64 | v35.56,18.41 43.81,18.41 48.9,23.5 53.34,23.5 v58.42,18.41
BUS9  (via drill 0.6)
  Top 0.254: IC6.22 IC8.3 v36.2,83.19 | IC10.3 v55.88,81.92 54.61,80.64 54.61,71.12 62.23,63.5 62.23,58.42 63.5,57.15 63.5,52.07 60.96,49.53 60.96,44.45 64.77,40.64 64.77,20.32 64.14,19.68 IC11.3 59.69,19.68 57.15,22.23 v57.15,26.04 | v34.29,19.68 IC9.3 30.48,19.68 26.67,23.5 IC7.22
  Bottom 0.254: v36.2,83.19 45.09,83.19 48.9,87 52.7,87 55.88,83.82 v55.88,81.92 | v34.29,19.68 42.55,19.68 48.9,26.04 v57.15,26.04
BUS10  (via drill 0.6)
  Top 0.254: IC6.23 IC8.2 v37.47,84.45 | IC10.2 v57.15,83.19 55.88,83.19 53.98,81.28 53.98,70.48 58.42,66.04 v58.42,28.57 58.42,22.23 59.69,20.95 IC11.2 | v35.56,20.95 IC9.2 30.48,20.95 26.67,24.77 IC7.23
  Bottom 0.254: v37.47,84.45 43.81,84.45 48.9,89.53 52.7,89.53 57.15,85.09 v57.15,83.19 | v58.42,28.57 48.9,28.57 41.27,20.95 v35.56,20.95
CDIR
  Top 0.254: IC6.6 14.61,79.38 12.06,76.83 7.62,76.83 CON_FDC.18
CDRSELA
  Top 0.254: IC6.8 14.61,76.83 9.53,71.75 7.62,71.75 CON_FDC.14
CDRSELB
  Top 0.254: IC6.9 14.61,75.56 10.16,71.12 10.16,69.85 9.53,69.22 7.62,69.22 CON_FDC.12
CHDSEL
  Top 0.254: IC6.2 12.06,84.45 10.16,86.36 10.16,91.44 9.53,92.08 7.62,92.08 CON_FDC.32
CINDEX
  Bottom 0.254: IC5.6 29.84,53.98 22.23,61.59 7.62,61.59 CON_FDC.8
CMOTENA
  Top 0.254: IC6.10 14.61,74.3 10.79,70.48 10.79,67.94 9.53,66.67 7.62,66.67 CON_FDC.10
CMOTENB
  Top 0.254: IC6.7 14.61,78.11 10.79,74.3 7.62,74.3 CON_FDC.16
CRDATA
  Bottom 0.254: CON_FDC.30 7.62,89.53 9.53,89.53 12.06,87 12.06,80.64 31.11,61.59 IC5.3
CRDY  (via drill 0.6)
  Top 0.254: v46.99,61.59 46.99,55.24 55.24,46.99 IC3.9
  Bottom 0.254: CON_FDC.34 7.62,94.61 9.53,94.61 12.7,91.44 12.7,81.28 31.11,62.87 45.72,62.87 v46.99,61.59
CREDWRC
  Top 0.254: IC6.11 14.61,73.03 11.43,69.85 11.43,58.42 9.53,56.52 7.62,56.52 CON_FDC.2
CSTEP
  Top 0.254: IC6.5 10.79,80.64 9.53,79.38 7.62,79.38 CON_FDC.20
CTRK0
  Bottom 0.254: CON_FDC.26 7.62,84.45 9.53,84.45 10.79,83.19 10.79,78.11 32.38,56.52 IC5.5
CWDATA
  Top 0.254: IC6.4 7.62,81.92 CON_FDC.22
CWGATE
  Top 0.254: IC6.3 10.79,83.19 9.53,84.45 7.62,84.45 CON_FDC.24
CWRPROT
  Bottom 0.254: CON_FDC.28 7.62,87 9.53,87 11.43,85.09 11.43,80.01 32.38,59.05 IC5.4
FDIR
  Top 0.254: CON_CRYO.18 7.62,23.5 9.53,23.5 10.16,22.86 10.16,22.23 12.7,19.68 IC7.6
FDRSELA
  Top 0.254: CON_CRYO.14 7.62,18.41 9.53,18.41 10.79,17.14 IC7.8
FDRSELB
  Top 0.254: CON_CRYO.12 7.62,15.88 IC7.9
FHDSEL
  Top 0.254: CON_CRYO.32 7.62,41.27 9.53,41.27 12.7,38.1 12.7,25.4 13.34,24.77 IC7.2
FINDEX
  Bottom 0.254: CON_CRYO.8 7.62,13.34 13.34,13.34 32.38,32.38 IC4.6
FMOTENA
  Top 0.254: CON_CRYO.10 7.62,13.34 9.53,13.34 10.79,14.61 IC7.10
FMOTENB
  Top 0.254: CON_CRYO.16 7.62,20.95 9.53,20.95 12.06,18.41 IC7.7
FRDATA
  Bottom 0.254: IC4.3 32.38,40.01 31.11,41.27 7.62,41.27 CON_CRYO.30
FRDY  (via drill 0.6)
  Top 0.254: CON_CRYO.34 13.97,52.7 v26.04,52.7
  Bottom 0.254: v26.04,52.7 58.42,52.7 59.69,53.98 IC3.7
FREDWRC
  Top 0.254: CON_CRYO.2 7.62,5.71 9.53,5.71 10.79,6.99 10.79,10.79 13.34,13.34 IC7.11
FSTEP
  Top 0.254: CON_CRYO.20 7.62,26.04 9.53,26.04 10.79,24.77 10.79,23.5 13.34,20.95 IC7.5
FTRK0
  Bottom 0.254: IC4.5 32.38,34.92 31.11,36.2 7.62,36.2 CON_CRYO.26
FWDATA
  Top 0.254: CON_CRYO.22 7.62,28.57 9.53,28.57 11.43,26.67 11.43,24.13 13.34,22.23 IC7.4
FWGATE
  Top 0.254: CON_CRYO.24 7.62,31.11 10.16,31.11 12.06,29.21 12.06,24.77 13.34,23.5 IC7.3
FWRPROT
  Bottom 0.254: IC4.4 32.38,37.47 31.11,38.73 7.62,38.73 CON_CRYO.28
GND  (via drill 0.6)
  Top 0.254: 60.96,8.26 IC11.12 IC11.13 | 15.24,12.06 IC7.12 | IC9.13 IC9.12 31.75,8.26 30.48,8.26 26.67,12.06 IC7.13 | 16.51,85.72 IC6.1 | 32.38,85.72 IC8.1
  Top 0.406: v60.96,6.35 60.96,8.26 | v18.41,71.75 IC6.12 | v29.21,71.75 IC8.12 | v57.15,70.48 IC10.12 | v15.24,10.16 15.24,12.06 | v31.75,6.35 31.75,8.26 | C8.2 16.51,88.27 16.51,85.72 | C9.2 32.38,88.27 32.38,85.72 | C10.2 60.96,87 60.96,84.45 IC10.1
  pour Route15: 0,99.69 99.69,99.69 99.69,0 0,0
INDEX  (via drill 0.6)
  Top 0.254: v83.82,71.75 83.82,54.61 80.01,50.8 v78.11,50.8 | IC4.8 40.01,29.84 38.73,31.11 38.73,50.8 39.37,51.44 IC5.8 42.55,51.44 v43.81,50.16
  Bottom 0.254: v83.82,71.75 94.61,71.75 95.89,73.03 IC1.7 | v78.11,50.8 77.47,51.44 45.09,51.44 v43.81,50.16
INDEX1
  Bottom 0.254: IC1.6 95.89,70.48 94.61,69.22 85.09,69.22 82.55,66.67 78.74,66.67 75.56,63.5 53.34,63.5 52.7,64.14 50.8,64.14 CONFD1.8
INDEX2  (via drill 0.6)
  Top 0.254: v56.52,36.83 55.24,35.56 55.24,15.88 52.7,13.34 50.8,13.34 CONFD2.8 | v85.09,66.67 85.09,54.61 72.39,41.91 72.39,38.73 v70.48,36.83
  Bottom 0.254: v56.52,36.83 v70.48,36.83 | v85.09,66.67 90.81,66.67 92.08,67.94 IC1.5
INDEX3
  Bottom 0.254: CONFD3.8 80.64,61.59 92.08,61.59 95.89,65.41 IC1.4
INDEX4
  Top 0.254: IC1.3 95.89,62.87 93.34,60.33 93.34,44.45 93.98,43.81 93.98,20.32 87,13.34 80.64,13.34 CONFD4.8
N$1
  Top 0.254: IC9.15 45.72,10.79 CONFD2.10
N$2
  Top 0.254: IC9.16 45.09,12.06 48.26,15.24 48.26,15.88 CONFD2.12
N$3
  Top 0.254: IC9.17 45.09,13.34 47.62,15.88 47.62,17.78 CONFD2.14
N$4
  Top 0.254: IC9.18 45.09,14.61 46.99,16.51 46.99,19.68 CONFD2.16
N$5
  Top 0.254: IC9.19 45.09,15.88 46.35,17.14 46.35,21.59 CONFD2.18
N$6
  Top 0.254: IC9.20 44.45,17.14 45.72,18.41 45.72,23.5 CONFD2.20
N$7
  Top 0.254: IC9.21 43.81,18.41 45.09,19.68 45.09,25.4 CONFD2.22
N$8
  Top 0.254: IC9.22 43.81,19.68 44.45,20.32 44.45,27.3 CONFD2.24
N$9
  Top 0.254: CONFD2.32 48.26,41.27 48.26,32.38 43.81,27.94 43.81,21.59 43.18,20.95 IC9.23
N$10
  Top 0.254: IC9.14 44.45,9.53 CONFD2.2
N$11
  Top 0.254: IC8.22 CONFD1.24
N$12
  Top 0.254: IC8.21 48.26,81.92 CONFD1.22
N$13
  Top 0.254: CONFD1.20 46.99,80.64 IC8.20
N$14
  Top 0.254: IC8.19 45.72,79.38 CONFD1.18
N$15
  Top 0.254: CONFD1.16 44.45,78.11 IC8.18
N$16
  Top 0.254: IC8.17 44.45,76.83 48.26,73.03 48.26,71.75 CONFD1.14
N$17
  Top 0.254: IC8.16 43.18,75.56 48.26,70.48 48.26,69.22 CONFD1.12
N$18  (via drill 0.6)
  Top 0.254: v97.16,45.72 98.42,44.45 98.42,20.95 97.16,19.68 IC2.1 | IC6.13 26.04,71.75 R1.2 13.34,57.15 13.34,53.98 2.54,43.18 SW2-1.1
  Bottom 0.254: 97.79,50.8 97.79,46.35 v97.16,45.72 | 97.79,50.8 97.79,57.15 97.16,57.78 IC1.1 95.25,57.78 93.98,59.05 77.47,59.05 73.66,62.87 53.98,62.87 52.7,61.59 48.9,61.59 46.35,64.14 IC5.13 39.37,65.41 30.48,65.41 R1.2 | 97.79,50.8 88.27,50.8 85.09,53.98 75.56,53.98 IC3.1
N$19
  Top 0.254: IC8.15 43.18,74.3 47.62,69.85 47.62,67.31 CONFD1.10
N$20
  Top 0.254: CONFD1.2 48.26,56.52 48.26,64.77 46.99,66.04 46.99,69.22 43.18,73.03 IC8.14
N$21
  Top 0.254: IC8.23 46.35,84.45 47.62,85.72 47.62,91.44 CONFD1.32
N$22
  Top 0.254: IC10.23 72.39,83.19 73.66,84.45 73.66,87.63 CONFD3.32
N$23
  Top 0.254: IC10.22 78.11,81.92 CONFD3.24
N$24
  Top 0.254: IC10.21 CONFD3.22
N$25
  Top 0.254: CONFD3.20 78.11,79.38 IC10.20
N$26
  Top 0.254: CONFD3.18 76.83,78.11 IC10.19
N$27
  Top 0.254: CONFD3.16 75.56,76.83 IC10.18
N$28
  Top 0.254: IC10.17 74.3,75.56 CONFD3.14
N$29
  Top 0.254: IC10.16 73.66,74.3 79.38,68.58 CONFD3.12
N$30
  Top 0.254: IC10.15 73.66,73.03 78.11,68.58 78.11,66.67 CONFD3.10
N$31
  Top 0.254: IC10.14 73.66,71.75 77.47,67.94 77.47,57.15 CONFD3.2
N$32
  Top 0.254: IC11.22 73.66,19.68 74.3,20.32 74.3,23.5 76.83,26.04 76.83,29.84 CONFD4.24
N$33
  Top 0.254: IC11.21 74.3,18.41 74.93,19.05 74.93,22.86 77.47,25.4 77.47,27.94 CONFD4.22
N$34
  Top 0.254: IC11.20 74.93,17.14 75.56,17.78 75.56,22.23 78.11,24.77 78.11,26.04 CONFD4.20
N$35
  Top 0.254: IC11.19 74.93,15.88 76.2,17.14 76.2,21.59 CONFD4.18
N$36
  Top 0.254: IC11.18 74.93,14.61 76.83,16.51 76.83,19.68 CONFD4.16
N$37
  Top 0.254: IC11.17 74.93,13.34 77.47,15.88 77.47,17.78 CONFD4.14
N$38
  Top 0.254: IC11.16 74.93,12.06 78.11,15.24 78.11,15.88 CONFD4.12
N$39
  Top 0.254: IC11.15 75.56,10.79 CONFD4.10
N$40
  Top 0.254: IC11.14 74.3,9.53 CONFD4.2
N$41
  Top 0.254: IC11.23 73.03,20.95 73.66,21.59 73.66,24.13 76.2,26.67 76.2,40.01 78.74,42.55 CONFD4.32
N$42  (via drill 0.6)
  Top 0.254: IC2.15 88.27,22.23 85.09,25.4 v85.09,41.27 85.72,41.91 85.72,58.42 87.63,60.33 IC1.15 | R2.2 15.24,26.04 IC7.1
  Bottom 0.254: 15.24,33.66 34.92,33.66 35.56,34.29 35.56,37.47 35.56,38.1 40.01,42.55 IC4.13 47.62,42.55 48.9,41.27 v85.09,41.27 83.19,43.18 83.19,45.72 82.55,46.35 78.11,46.35 75.56,48.9 73.66,48.9 72.39,47.62 IC3.15 | 15.24,33.66 SW2-2.1 | 15.24,33.66 R2.2
N$43
  Top 0.254: D3.C 12.7,48.9 12.7,47.62 R4.1 29.21,31.11 29.21,23.5 30.48,22.23 IC9.1
  Bottom 0.254: SW1-2.1 D3.C
N$44
  Top 0.406: J1.4 95.89,88.27 97.16,87 SJ1.3
N$45  (via drill 0.6)
  Top 0.254: IC11.1 60.96,22.23 R6.1 v60.96,42.55
  Bottom 0.254: SW1-4.1 13.97,46.35 16.51,43.81 59.69,43.81 v60.96,42.55
N$46  (via drill 0.6)
  Top 0.254: IC10.13 70.48,70.48 R5.1 70.48,62.23 v69.22,60.96 | v30.48,55.24 25.4,50.16 16.51,50.16 D4.C
  Bottom 0.254: SW1-3.1 D4.C | v30.48,55.24 47.62,55.24 48.9,56.52 52.7,56.52 57.78,61.59 68.58,61.59 v69.22,60.96
N$47  (via drill 0.6)
  Top 0.254: IC2.14 87,24.77 85.72,26.04 85.72,40.01 87,41.27 v87,45.09 86.36,45.72 86.36,53.98 88.27,55.88 89.53,55.88 90.81,57.15 90.81,61.59 89.53,62.87 IC1.14
  Bottom 0.254: 69.85,49.53 52.7,49.53 52.07,48.9 25.4,48.9 D3.A D2.A | 69.85,49.53 IC3.14 | v87,45.09 85.09,46.99 78.74,46.99 76.2,49.53 69.85,49.53 | R7.1 91.44,17.14 91.44,23.5 90.17,24.77 IC2.14
N$48  (via drill 0.6)
  Top 0.254: 94.61,22.23 94.61,16.51 R8.1 | IC1.2 95.25,60.33 94.61,59.69 v94.61,48.26 94.61,22.23 | 94.61,22.23 IC2.2
  Bottom 0.254: v94.61,48.26 82.55,48.26 78.74,52.07 72.39,52.07 | 72.39,52.07 43.81,52.07 41.27,49.53 26.67,49.53 24.13,52.07 24.13,55.24 D1.A 21.59,55.24 21.59,50.16 D4.A | IC3.2 72.39,52.07
N$49
  Top 0.406: J1.1 95.89,80.64 97.16,81.92 SJ1.1
N$51  (via drill 0.6)
  Top 0.254: D2.C D1.C 18.41,56.52 v29.84,67.94 | IC8.13 41.91,71.75 R3.1
  Bottom 0.254: v29.84,67.94 40.01,67.94 R3.1 | D2.C SW1-1.1
RDATA  (via drill 0.6)
  Top 0.254: IC5.11 40.01,59.05 37.47,56.52 v37.47,37.47 | v88.9,52.07 IC2.9
  Bottom 0.254: v37.47,37.47 IC4.11 | IC5.11 52.7,59.05 55.88,62.23 73.03,62.23 78.74,56.52 84.45,56.52 v88.9,52.07
RDATA1
  Bottom 0.254: CONFD1.30 50.8,92.08 92.08,92.08 98.42,85.72 98.42,45.09 94.61,41.27 89.53,41.27 87,38.73 87,36.2 88.27,34.92 IC2.10
RDATA2
  Bottom 0.254: IC2.11 83.82,32.38 82.55,33.66 57.78,33.66 52.7,38.73 50.8,38.73 CONFD2.30
RDATA3  (via drill 0.6)
  Top 0.254: v74.93,83.19 74.93,86.36 CONFD3.30 | v74.93,68.58 76.83,66.67 76.83,55.88 v80.01,52.7 | IC2.12 88.27,29.84 86.36,31.75 86.36,39.37 88.27,41.27 88.27,48.9 v87.63,49.53
  Bottom 0.254: v74.93,83.19 v74.93,68.58 | v87.63,49.53 84.45,52.7 v80.01,52.7
RDATA4  (via drill 0.6)
  Top 0.254: v83.82,27.3 83.82,37.47 82.55,38.73 80.64,38.73 CONFD4.30
  Bottom 0.254: v83.82,27.3 IC2.13
RDY1  (via drill 0.6)
  Top 0.254: IC3.10 59.69,49.53 62.23,52.07 IC3.6 | v64.14,59.69 64.14,87.63 54.61,97.16 50.8,97.16 CONFD1.34
  Bottom 0.254: IC3.6 62.23,57.78 v64.14,59.69
RDY2
  Top 0.254: IC3.11 62.23,49.53 64.77,52.07 IC3.5
  Bottom 0.254: CONFD2.34 53.34,48.9 60.96,48.9 62.23,47.62 IC3.11
RDY3
  Top 0.254: IC3.12 64.77,49.53 67.31,52.07 IC3.4 67.31,58.42 65.41,60.33 65.41,87.63 73.66,95.89 CONFD3.34
RDY4
  Top 0.254: IC3.13 67.31,49.53 69.85,52.07 IC3.3
  Bottom 0.254: CONFD4.34 68.58,45.09 67.31,46.35 IC3.13
TRK0  (via drill 0.6)
  Top 0.254: v59.69,60.33 v59.69,64.77 | v45.72,41.27 45.72,51.44 43.18,53.98 IC5.9
  Bottom 0.254: v59.69,64.77 60.33,64.14 74.93,64.14 76.2,65.41 76.2,71.75 78.74,74.3 87,74.3 88.27,75.56 IC1.9 | v59.69,60.33 53.34,53.98 IC5.9 | IC4.9 45.72,37.47 v45.72,41.27
TRKZ1  (via drill 0.6)
  Top 0.254: v57.78,90.81 53.98,87 50.8,87 CONFD1.26
  Bottom 0.254: v57.78,90.81 77.47,90.81 78.74,89.53 82.55,89.53 86.36,85.72 86.36,80.64 90.81,76.2 90.81,74.3 89.53,73.03 IC1.10
TRKZ2  (via drill 0.6)
  Top 0.254: IC1.11 89.53,70.48 92.08,67.94 v92.08,42.55 | v55.24,38.73 52.7,36.2 50.8,36.2 CONFD2.26
  Bottom 0.254: v92.08,42.55 89.53,42.55 85.72,38.73 v55.24,38.73
TRKZ3
  Top 0.254: CONFD3.26 80.64,87 82.55,87 85.72,83.82 85.72,70.48 88.27,67.94 IC1.12
TRKZ4  (via drill 0.6)
  Top 0.254: v93.98,66.67 97.79,66.67 98.42,66.04 98.42,49.53 v95.89,46.99 | v84.45,43.81 83.19,42.55 83.19,41.91 82.55,41.27 78.74,41.27 77.47,40.01 77.47,36.83 CONFD4.26
  Bottom 0.254: v84.45,43.81 92.71,43.81 v95.89,46.99 | IC1.13 92.71,65.41 v93.98,66.67
VCC
  Top 0.254: 25.4,26.04 IC7.24 | 41.27,22.23 IC9.24 | 25.4,85.72 IC6.24 | 41.27,85.72 IC8.24
  Top 0.406: C5.1 25.4,26.04 | C6.1 41.27,24.77 41.27,22.23 | C8.1 25.4,88.27 25.4,85.72 | C9.1 41.27,88.27 41.27,85.72 | C7.1 70.48,24.77 70.48,22.23 IC11.24 | C10.1 69.85,87 69.85,84.45 IC10.24 | SJ1.2 C12.+
  pour Route2: 0,99.69 99.69,99.69 99.69,0 0,0
WRPROT  (via drill 0.6)
  Top 0.254: v90.81,40.01 v90.81,45.09 | IC5.10 41.91,56.52 46.99,51.44 v46.99,50.16 46.99,40.64 41.27,34.92 IC4.10
  Bottom 0.254: v90.81,45.09 88.27,47.62 79.38,47.62 76.83,50.16 v46.99,50.16 | IC2.7 95.89,34.92 v90.81,40.01
WRPROT1  (via drill 0.6)
  Top 0.254: v54.61,89.53 50.8,89.53 CONFD1.28 | v92.08,34.92 92.08,36.83 89.53,39.37 89.53,45.72 91.44,47.62 91.44,65.41 90.17,66.67 87.63,66.67 85.09,69.22 85.09,81.92 82.55,84.45 v76.83,84.45
  Bottom 0.254: v54.61,89.53 71.75,89.53 v76.83,84.45 | IC2.6 94.61,32.38 v92.08,34.92
WRPROT2
  Bottom 0.254: IC2.5 92.08,29.84 90.81,31.11 57.78,31.11 52.7,36.2 50.8,36.2 CONFD2.28
WRPROT3  (via drill 0.6)
  Top 0.254: CONFD3.28 80.64,89.53 82.55,89.53 86.36,85.72 86.36,80.64 92.71,74.3 92.71,43.81 93.34,43.18 93.34,27.94 v92.71,27.3
  Bottom 0.254: IC2.4 v92.71,27.3
WRPROT4
  Bottom 0.254: CONFD4.28 80.64,36.2 82.55,36.2 85.09,33.66 90.81,33.66 93.34,31.11 97.79,31.11 98.42,30.48 98.42,26.04 97.16,24.77 IC2.3

### Text on the board
tNames: GND